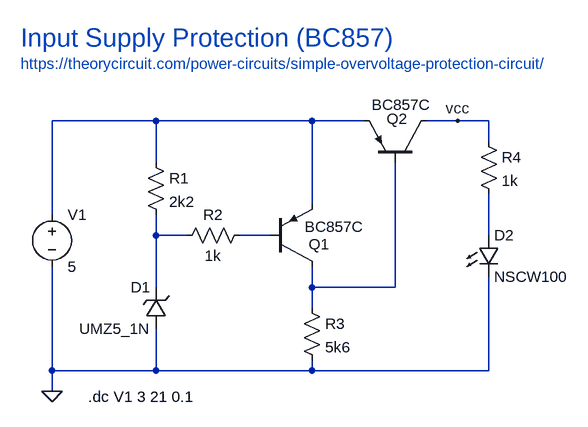
[diagram p0: schematic 01-input_voltage_5v.asc]
01-input_voltage_5v.asc, the LTspice schematic file:
Version 4
SHEET 1 912 680
WIRE 176 -48 16 -48
WIRE 416 -48 176 -48
WIRE 496 -48 416 -48
WIRE 640 -48 592 -48
WIRE 688 -48 640 -48
WIRE 688 -16 688 -48
WIRE 176 16 176 -48
WIRE 416 80 416 -48
WIRE 16 96 16 -48
WIRE 176 128 176 96
WIRE 224 128 176 128
WIRE 352 128 304 128
WIRE 688 128 688 64
WIRE 176 208 176 128
WIRE 416 208 416 176
WIRE 544 208 544 16
WIRE 544 208 416 208
WIRE 416 240 416 208
WIRE 16 336 16 176
WIRE 176 336 176 272
WIRE 176 336 16 336
WIRE 416 336 416 320
WIRE 416 336 176 336
WIRE 688 336 688 192
WIRE 688 336 416 336
WIRE 16 368 16 336
FLAG 16 368 0
FLAG 640 -48 vcc
SYMBOL voltage 16 80 R0
WINDOW 123 0 0 Left 0
WINDOW 39 0 0 Left 0
SYMATTR InstName V1
SYMATTR Value 5
SYMBOL res 160 0 R0
SYMATTR InstName R1
SYMATTR Value 2k2
SYMBOL zener 192 272 R180
WINDOW 0 24 64 Left 2
WINDOW 3 24 0 Left 2
SYMATTR InstName D1
SYMATTR Value UMZ5_1N
SYMATTR Description Diode
SYMATTR Type diode
SYMBOL res 320 112 R90
WINDOW 0 0 56 VBottom 2
WINDOW 3 32 56 VTop 2
SYMATTR InstName R2
SYMATTR Value 1k
SYMBOL pnp 352 176 M180
WINDOW 0 59 34 Left 2
WINDOW 3 53 61 Left 2
SYMATTR InstName Q1
SYMATTR Value BC857C
SYMBOL pnp 592 16 M270
WINDOW 0 67 61 VLeft 2
WINDOW 3 89 84 VLeft 2
SYMATTR InstName Q2
SYMATTR Value BC857C
SYMBOL res 400 224 R0
SYMATTR InstName R3
SYMATTR Value 5k6
SYMBOL res 672 -32 R0
SYMATTR InstName R4
SYMATTR Value 1k
SYMBOL LED 672 128 R0
SYMATTR InstName D2
SYMATTR Value NSCW100
SYMATTR Description Diode
SYMATTR Type diode
TEXT 72 376 Left 2 !.dc V1 3 21 0.1
TEXT -32 -136 Left 2 ;https://theorycircuit.com/power-circuits/simple-overvoltage-protection-circuit/
TEXT -32 -176 Left 4 ;Input Supply Protection (BC857)

The netlist it stands for:
* 01-input_voltage_5v.asc
V1 N001 0 5
R1 N001 N002 2k2
D1 0 N002 UMZ5_1N
R2 N003 N002 1k
Q1 N005 N003 N001 0 BC857C
Q2 vcc N005 N001 0 BC857C
R3 N005 0 5k6
R4 vcc N004 1k
D2 N004 0 NSCW100
.model D D
.lib standard.dio
.model NPN NPN
.model PNP PNP
.lib standard.bjt
.dc V1 3 21 0.1
* https://theorycircuit.com/power-circuits/simple-overvoltage-protection-circuit/
* Input Supply Protection (BC857)
.backanno
.end

* Results of the author's LTspice run, read from the files saved beside the schematic
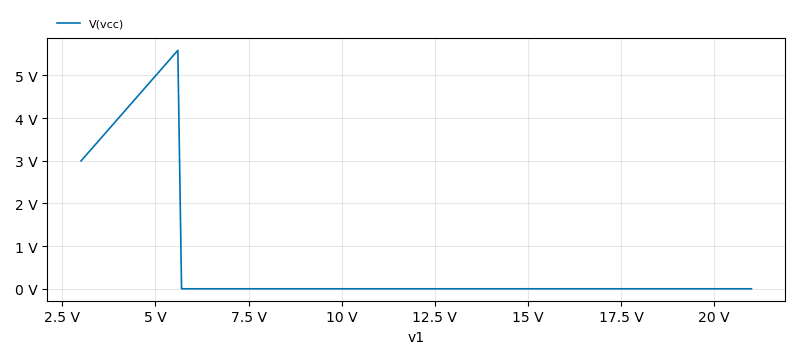
[diagram p1: DC transfer characteristic of 01-input_voltage_5v.asc, plotted from the saved traces]
* DC transfer characteristic, 1 run:
*   V(vcc): 2.994 V at v1=3 V, 311.5 µV at v1=21 V, min 86.48 µV, max 5.585 V